# Altium schematic sheet -5v_Reg_biggr.SchDoc: -5V Digital Regulator
size A4; Organization: Altium Limited; Address1: L3, 12a Rodborough Rd; Address2: Frenchs Forest; Address3: NSW; Address4: Australia 2086
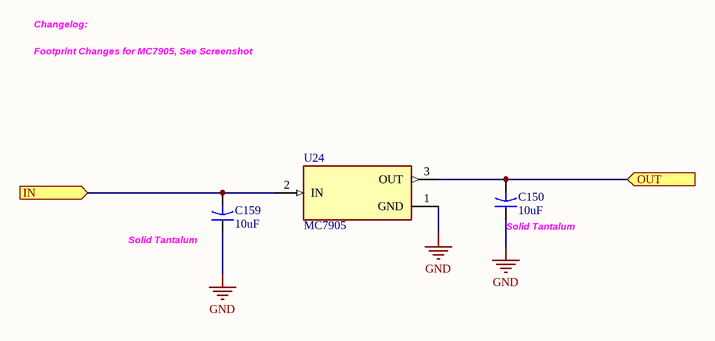
[diagram p0: -5v_Reg_biggr.SchDoc]

## Parts
C150  10uF  [Tantalum_2917]
C159  10uF  [Tantalum_2917]
U24  MC7905  [MC7905]

## Ports
IN (in), OUT (in)

## Nets
GND: C150.1 C159.1 U24.1(GND)
IN: C159.2 U24.2(IN) ; port IN
OUT: C150.2 U24.3(OUT) ; port OUT

## Notes on the sheet
- Changelog:
- Footprint Changes for MC7905, See Screenshot
- (near C159) Solid Tantalum
- (near C150) Solid Tantalum
- Title
- Date:
- RE:
- Arturo di Girolamo
- Size:
- A3
- A

## Library data of the parts
C150 C159 = UVR1V102MHD1TO: Capacitor, 100uF NICHICON; ASYPN: T495D106K035ATE260; MFGPN: UVR1V102MHD1TO